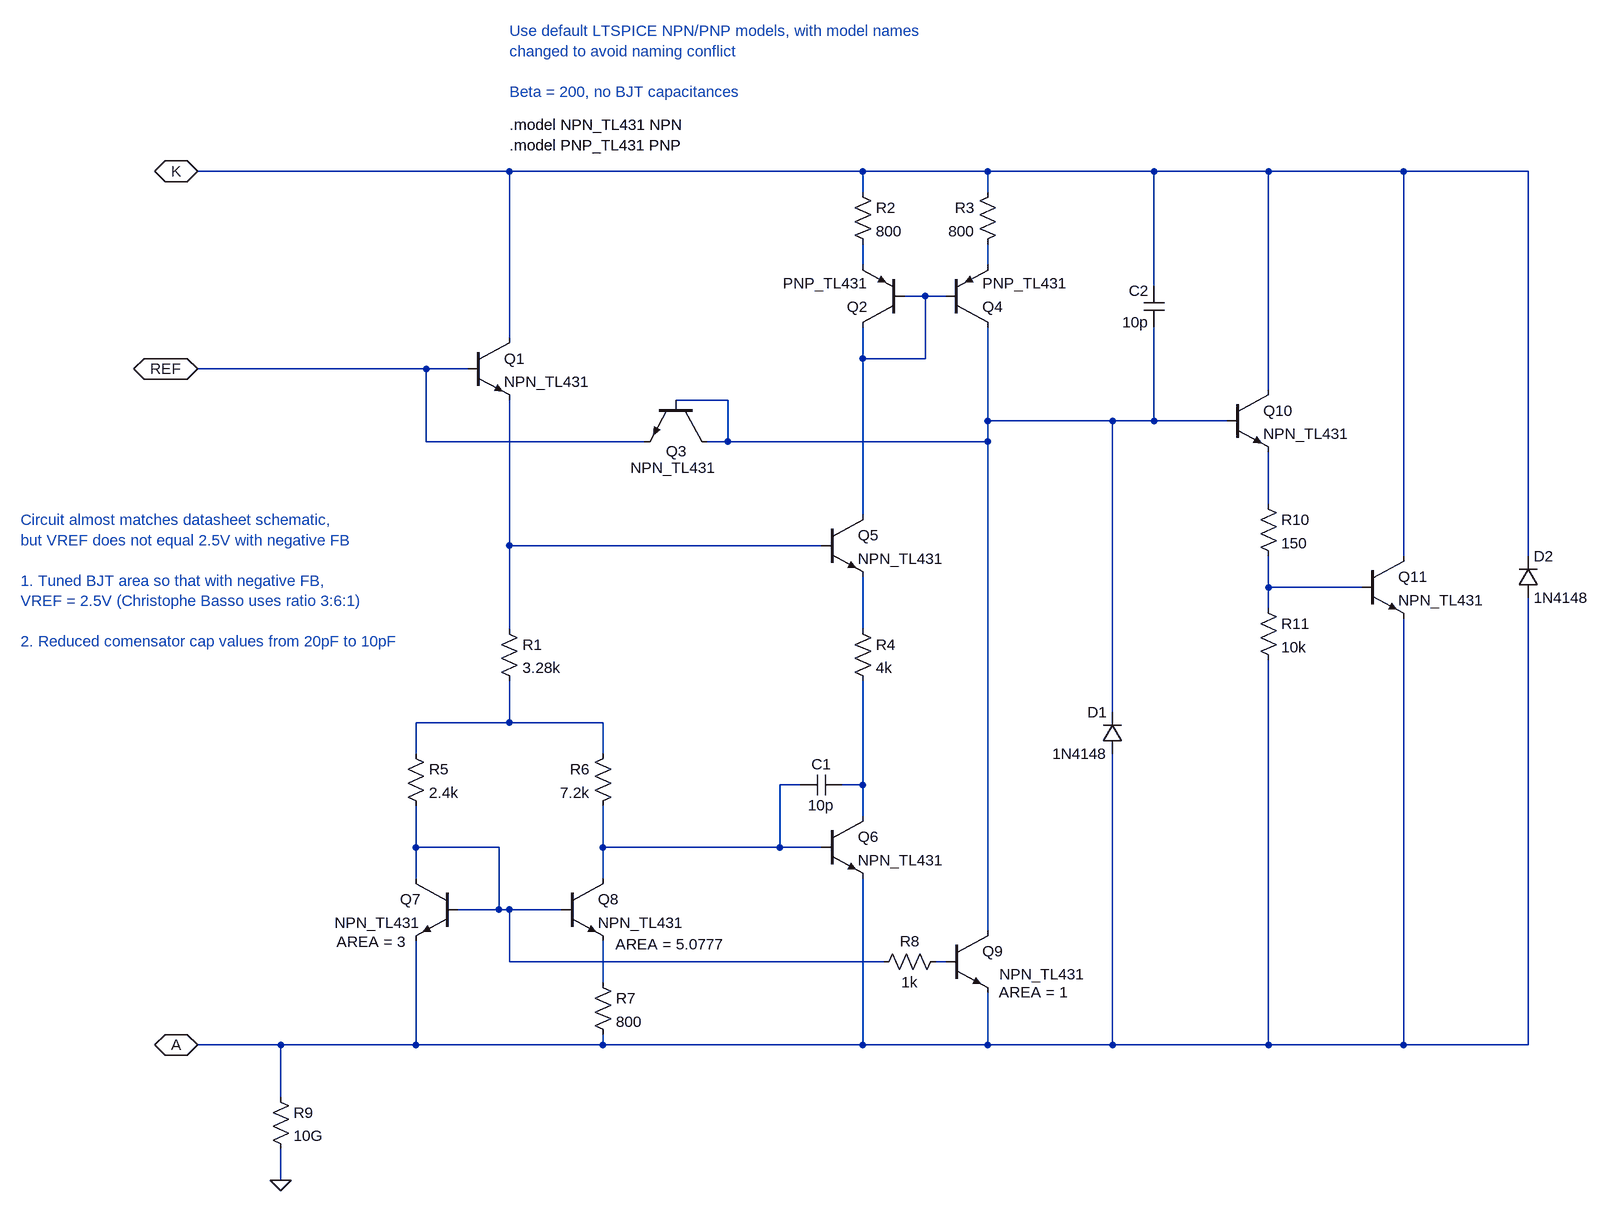
[diagram p0: schematic TL431.asc]
TL431.asc, the LTspice schematic file:
Version 4.1
SHEET 1 2508 1384
WIRE 128 -304 -352 -304
WIRE 672 -304 128 -304
WIRE 864 -304 672 -304
WIRE 1120 -304 864 -304
WIRE 1296 -304 1120 -304
WIRE 1504 -304 1296 -304
WIRE 1696 -304 1504 -304
WIRE 672 -272 672 -304
WIRE 864 -272 864 -304
WIRE 672 -160 672 -192
WIRE 864 -160 864 -192
WIRE 1120 -128 1120 -304
WIRE 768 -112 736 -112
WIRE 800 -112 768 -112
WIRE 128 -48 128 -304
WIRE 672 -16 672 -64
WIRE 768 -16 768 -112
WIRE 768 -16 672 -16
WIRE 0 0 -352 0
WIRE 64 0 0 0
WIRE 1296 32 1296 -304
WIRE 464 48 384 48
WIRE 864 80 864 -64
WIRE 1056 80 864 80
WIRE 1120 80 1120 -64
WIRE 1120 80 1056 80
WIRE 1232 80 1120 80
WIRE 0 112 0 0
WIRE 336 112 0 112
WIRE 464 112 464 48
WIRE 464 112 432 112
WIRE 864 112 864 80
WIRE 864 112 464 112
WIRE 1296 208 1296 128
WIRE 672 224 672 -16
WIRE 128 272 128 48
WIRE 608 272 128 272
WIRE 1504 288 1504 -304
WIRE 1696 288 1696 -304
WIRE 1296 336 1296 288
WIRE 1440 336 1296 336
WIRE 1296 368 1296 336
WIRE 128 400 128 272
WIRE 672 400 672 320
WIRE 1056 528 1056 80
WIRE 128 544 128 480
WIRE 128 544 -16 544
WIRE 272 544 128 544
WIRE -16 592 -16 544
WIRE 272 592 272 544
WIRE 576 640 544 640
WIRE 672 640 672 480
WIRE 672 640 640 640
WIRE 672 688 672 640
WIRE -16 736 -16 672
WIRE 112 736 -16 736
WIRE 272 736 272 672
WIRE 544 736 544 640
WIRE 544 736 272 736
WIRE 608 736 544 736
WIRE -16 784 -16 736
WIRE 272 784 272 736
WIRE 112 832 112 736
WIRE 112 832 48 832
WIRE 128 832 112 832
WIRE 208 832 128 832
WIRE 864 864 864 112
WIRE 128 912 128 832
WIRE 704 912 128 912
WIRE 800 912 784 912
WIRE 272 944 272 880
WIRE -224 1040 -352 1040
WIRE -16 1040 -16 880
WIRE -16 1040 -224 1040
WIRE 272 1040 272 1024
WIRE 272 1040 -16 1040
WIRE 672 1040 672 784
WIRE 672 1040 272 1040
WIRE 864 1040 864 960
WIRE 864 1040 672 1040
WIRE 1056 1040 1056 592
WIRE 1056 1040 864 1040
WIRE 1296 1040 1296 448
WIRE 1296 1040 1056 1040
WIRE 1504 1040 1504 384
WIRE 1504 1040 1296 1040
WIRE 1696 1040 1696 352
WIRE 1696 1040 1504 1040
WIRE -224 1120 -224 1040
WIRE -224 1248 -224 1200
FLAG -224 1248 0
FLAG -352 0 REF
IOPIN -352 0 BiDir
FLAG -352 -304 K
IOPIN -352 -304 BiDir
FLAG -352 1040 A
IOPIN -352 1040 BiDir
SYMBOL npn 64 -48 R0
SYMATTR InstName Q1
SYMATTR Value NPN_TL431
SYMBOL pnp 736 -64 R180
SYMATTR InstName Q2
SYMATTR Value PNP_TL431
SYMBOL npn 432 48 R90
WINDOW 0 79 31 VRight 2
WINDOW 3 104 -15 VRight 2
SYMATTR InstName Q3
SYMATTR Value NPN_TL431
SYMBOL res 112 384 R0
SYMATTR InstName R1
SYMATTR Value 3.28k
SYMBOL pnp 800 -64 M180
SYMATTR InstName Q4
SYMATTR Value PNP_TL431
SYMBOL res 656 -288 R0
SYMATTR InstName R2
SYMATTR Value 800
SYMBOL res 880 -288 M0
SYMATTR InstName R3
SYMATTR Value 800
SYMBOL npn 608 224 R0
SYMATTR InstName Q5
SYMATTR Value NPN_TL431
SYMBOL res 656 384 R0
SYMATTR InstName R4
SYMATTR Value 4k
SYMBOL npn 608 688 R0
SYMATTR InstName Q6
SYMATTR Value NPN_TL431
SYMBOL cap 640 624 R90
WINDOW 0 0 32 VBottom 2
WINDOW 3 32 32 VTop 2
SYMATTR InstName C1
SYMATTR Value 10p
SYMBOL npn 48 784 M0
WINDOW 123 80 97 Left 2
SYMATTR Value2 AREA = 3
SYMATTR InstName Q7
SYMATTR Value NPN_TL431
SYMBOL npn 208 784 R0
WINDOW 123 83 101 Left 2
SYMATTR Value2 AREA = 5.0777
SYMATTR InstName Q8
SYMATTR Value NPN_TL431
SYMBOL res -32 576 R0
SYMATTR InstName R5
SYMATTR Value 2.4k
SYMBOL res 288 576 M0
SYMATTR InstName R6
SYMATTR Value 7.2k
SYMBOL res 256 928 R0
SYMATTR InstName R7
SYMATTR Value 800
SYMBOL npn 800 864 R0
WINDOW 123 81 95 Left 2
WINDOW 3 82 67 Left 2
SYMATTR Value2 AREA = 1
SYMATTR Value NPN_TL431
SYMATTR InstName Q9
SYMBOL res 688 928 R270
WINDOW 0 32 56 VTop 2
WINDOW 3 0 56 VBottom 2
SYMATTR InstName R8
SYMATTR Value 1k
SYMBOL res -240 1104 R0
SYMATTR InstName R9
SYMATTR Value 10G
SYMBOL diode 1072 592 R180
WINDOW 0 24 64 Left 2
WINDOW 3 24 0 Left 2
SYMATTR InstName D1
SYMATTR Value 1N4148
SYMBOL cap 1136 -128 M0
SYMATTR InstName C2
SYMATTR Value 10p
SYMBOL npn 1232 32 R0
SYMATTR InstName Q10
SYMATTR Value NPN_TL431
SYMBOL res 1280 192 R0
SYMATTR InstName R10
SYMATTR Value 150
SYMBOL res 1280 352 R0
SYMATTR InstName R11
SYMATTR Value 10k
SYMBOL npn 1440 288 R0
SYMATTR InstName Q11
SYMATTR Value NPN_TL431
SYMBOL diode 1680 352 M180
WINDOW 0 24 64 Left 2
WINDOW 3 24 0 Left 2
SYMATTR InstName D2
SYMATTR Value 1N4148
TEXT -624 232 Left 2 ;Circuit almost matches datasheet schematic, \nbut VREF does not equal 2.5V with negative FB\n \n1. Tuned BJT area so that with negative FB,\nVREF = 2.5V (Christophe Basso uses ratio 3:6:1)\n \n2. Reduced comensator cap values from 20pF to 10pF
TEXT 128 -376 Left 2 !.model NPN_TL431 NPN
TEXT 128 -344 Left 2 !.model PNP_TL431 PNP
TEXT 128 -520 Left 2 ;Use default LTSPICE NPN/PNP models, with model names\nchanged to avoid naming conflict\n \nBeta = 200, no BJT capacitances

The netlist it stands for:
* TL431.asc
Q1 K REF N006 0 NPN_TL431
Q2 N003 N003 N001 0 PNP_TL431
Q3 N004 N004 REF 0 NPN_TL431
R1 N006 N009 3.28k
Q4 N004 N003 N002 0 PNP_TL431
R2 K N001 800
R3 K N002 800
Q5 N003 N006 N008 0 NPN_TL431
R4 N008 N011 4k
Q6 N011 N010 A 0 NPN_TL431
C1 N011 N010 10p
Q7 N012 N012 A 0 NPN_TL431 AREA = 3
Q8 N010 N012 N014 0 NPN_TL431 AREA = 5.0777
R5 N009 N012 2.4k
R6 N009 N010 7.2k
R7 N014 A 800
Q9 N004 N013 A 0 NPN_TL431 AREA = 1
R8 N012 N013 1k
R9 A 0 10G
D1 A N004 1N4148
C2 K N004 10p
Q10 K N004 N005 0 NPN_TL431
R10 N005 N007 150
R11 N007 A 10k
Q11 K N007 A 0 NPN_TL431
D2 A K 1N4148
.model D D
.lib standard.dio
.model NPN NPN
.model PNP PNP
.lib standard.bjt
* Circuit almost matches datasheet schematic,
* but VREF does not equal 2.5V with negative FB
* 1. Tuned BJT area so that with negative FB,
* VREF = 2.5V (Christophe Basso uses ratio 3:6:1)
* 2. Reduced comensator cap values from 20pF to 10pF
.model NPN_TL431 NPN
.model PNP_TL431 PNP
* Use default LTSPICE NPN/PNP models, with model names
* changed to avoid naming conflict
* Beta = 200, no BJT capacitances
.backanno
.end